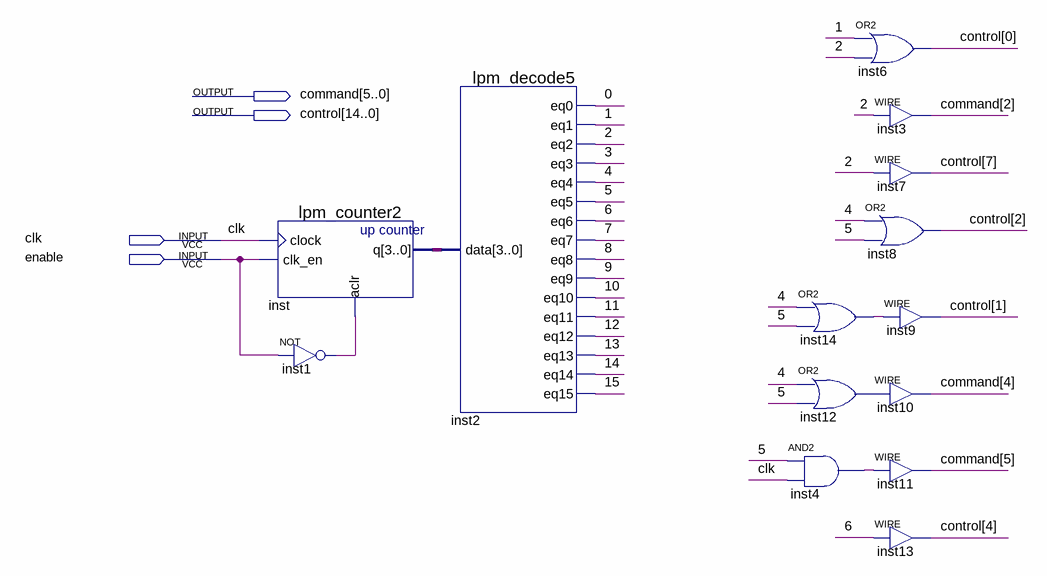
[diagram p0: schematic sheet]
// Quartus schematic mov1.bdf as structural Verilog: 14 symbols, 4 pins
module mov1 (
  input  clk,
  input  enable,
  output [5:0] command,
  output [14:0] control
);

  wire \0 , \1 , \2 , \3 , \4 , \5 , \6 , \7 , \8 , \9 , \10 , \11 , \12 , \13 , \14 , \15 , inst1_out,
       inst4_out, inst12_out, inst14_out;
  wire [3:0] inst_q;

  lpm_counter2 inst (.clock(clk), .clk_en(enable), .aclr(inst1_out), .q(inst_q));
  not inst1 (inst1_out, enable);
  lpm_decode5 inst2 (
    .data(inst_q), .eq0(\0 ), .eq1(\1 ), .eq2(\2 ), .eq3(\3 ), .eq4(\4 ), .eq5(\5 ), .eq6(\6 ), .eq7(\7 ),
    .eq8(\8 ), .eq9(\9 ), .eq10(\10 ), .eq11(\11 ), .eq12(\12 ), .eq13(\13 ), .eq14(\14 ), .eq15(\15 ));
  or inst14 (inst14_out, \4 , \5 );
  or inst12 (inst12_out, \4 , \5 );
  and inst4 (inst4_out, \5 , clk);
  or inst6 (control[0], \1 , \2 );
  assign command[2] = \2 ;  // WIRE inst3
  assign control[7] = \2 ;  // WIRE inst7
  or inst8 (control[2], \4 , \5 );
  assign control[1] = inst14_out;  // WIRE inst9
  assign command[4] = inst12_out;  // WIRE inst10
  assign command[5] = inst4_out;  // WIRE inst11
  assign control[4] = \6 ;  // WIRE inst13
endmodule
